# EAGLE design lasersupply_smd (EAGLE 5.11)
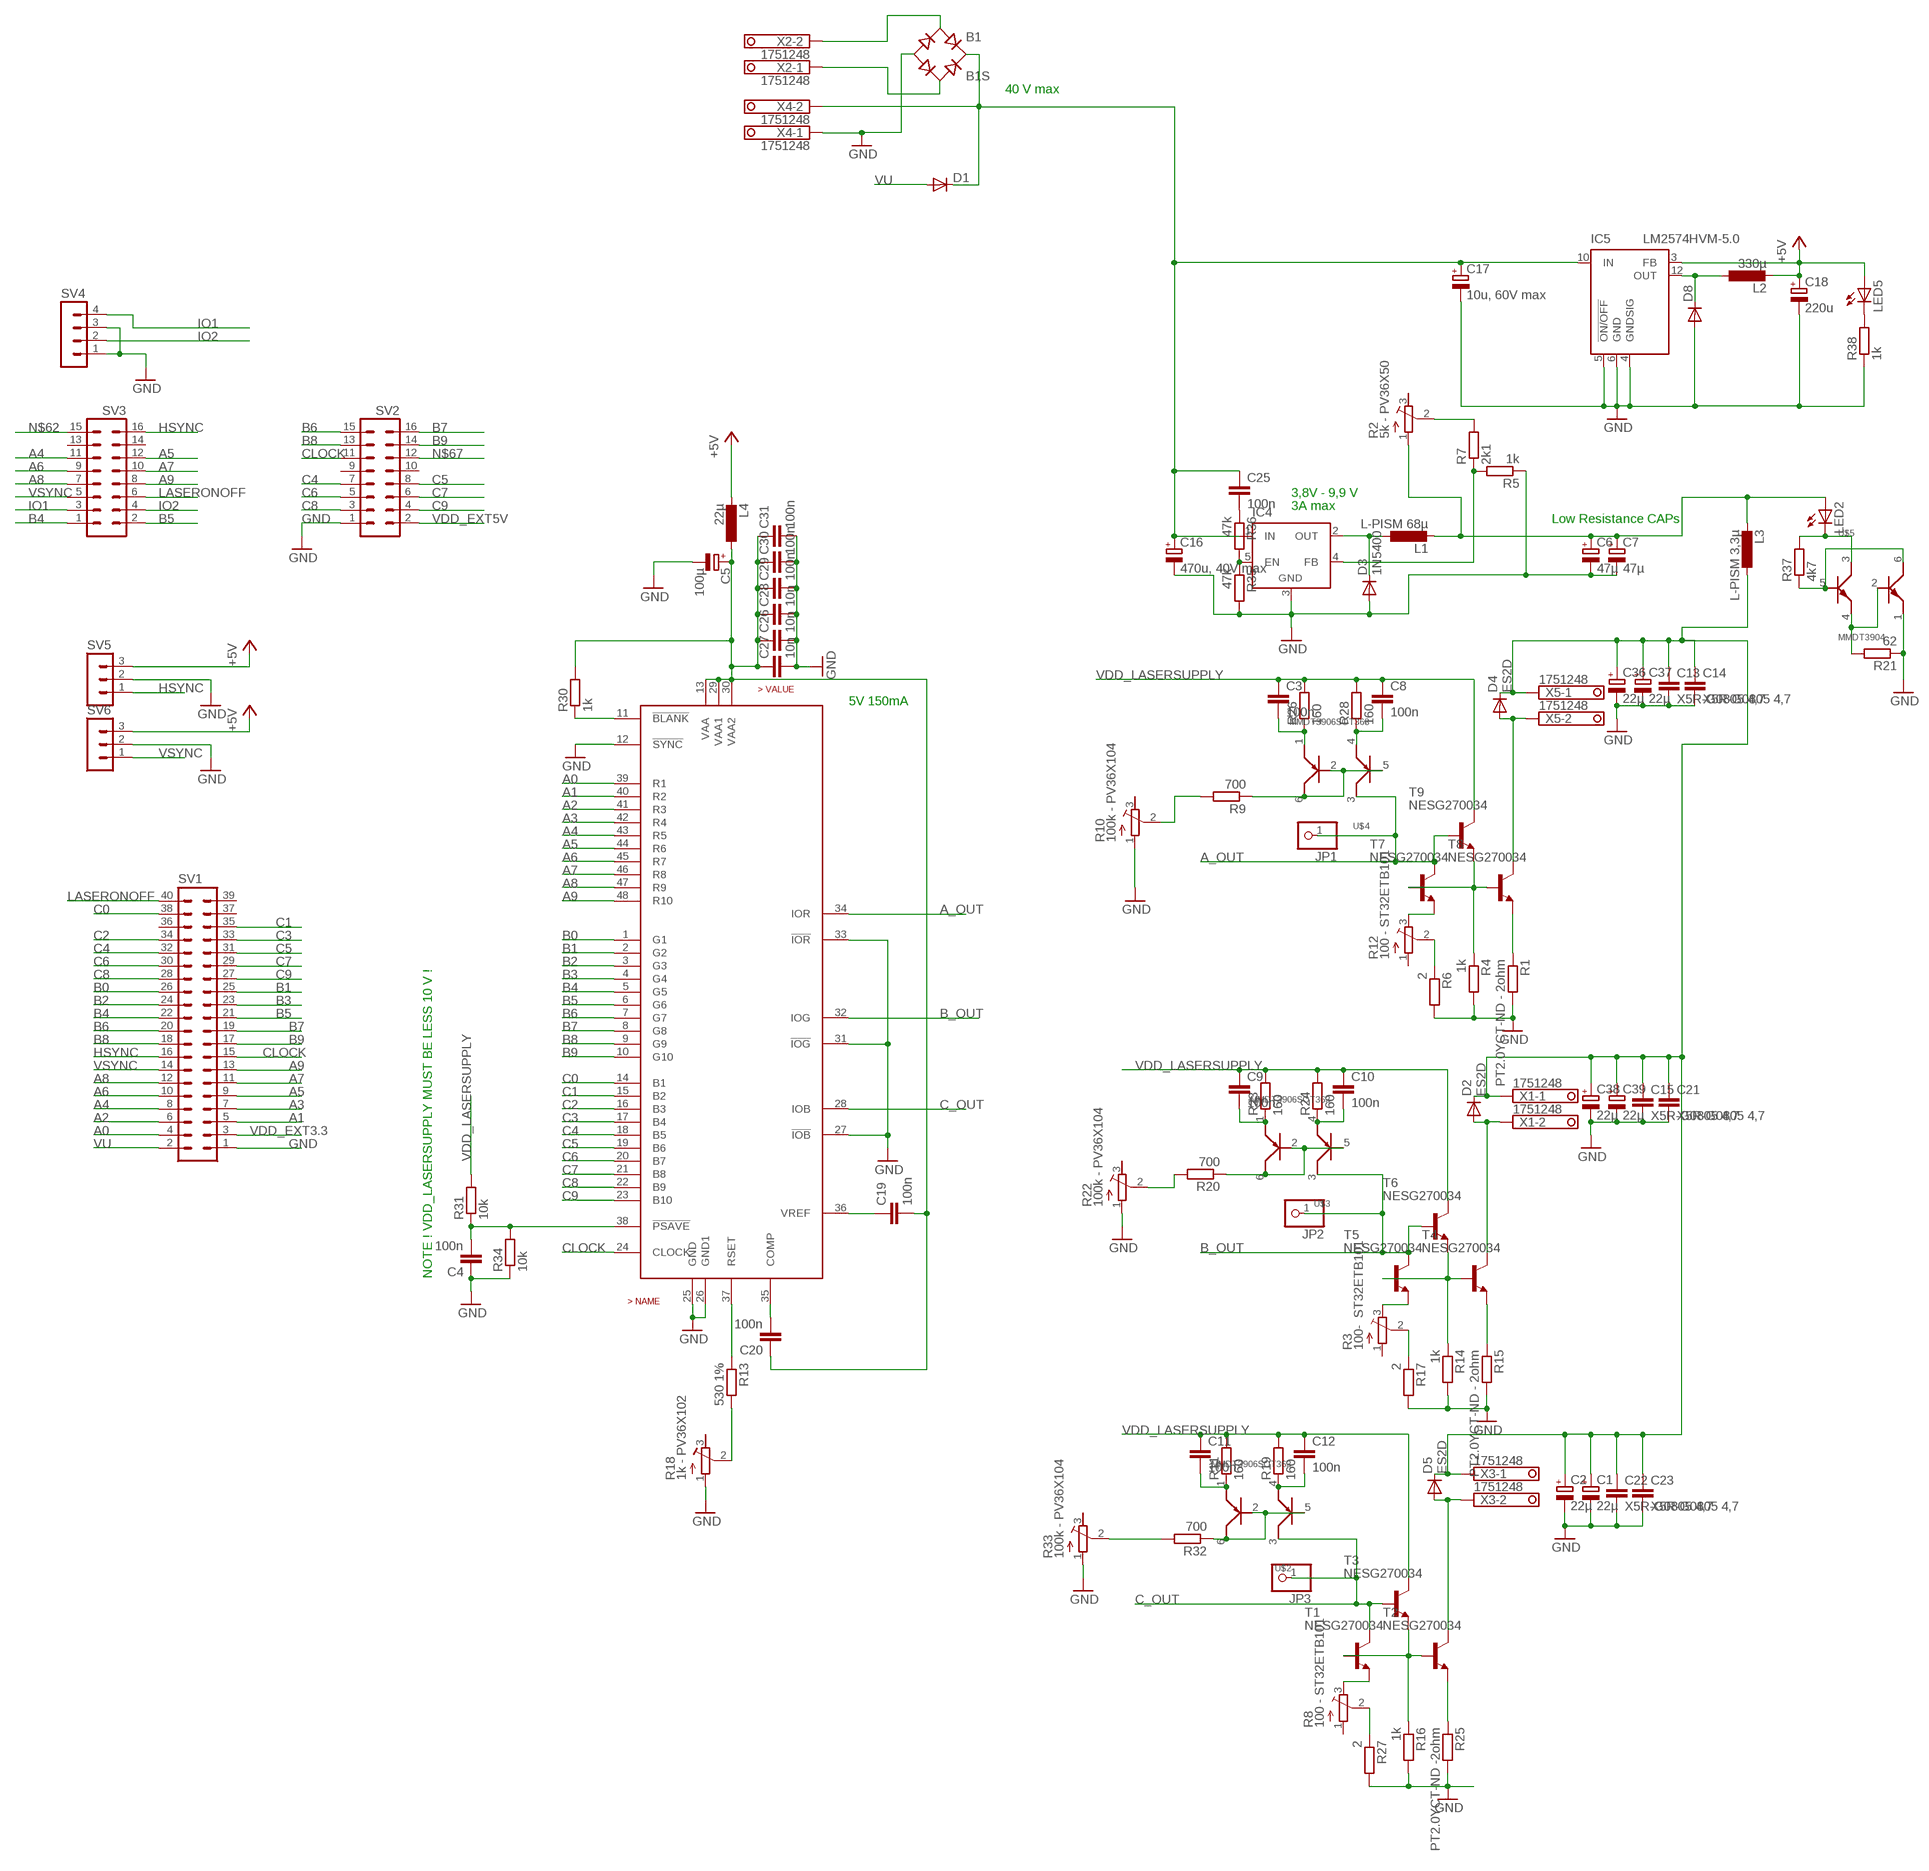
[diagram p0: schematic, sheet 1]

## Parts
B1  B1S  [MBS]
C1  22µ  CPOL-EUD  [PANASONIC_D]
C2  22µ  CPOL-EUD  [PANASONIC_D]
C3  100n  C-EUC0805  [C0805]
C4  100n  C-EUC0603  [C0603]
C5  100µ  CPOL-EUD  [PANASONIC_D]
C6  47µ  CPOL-EUD  [PANASONIC_D]
C7  47µ  CPOL-EUD  [PANASONIC_D]
C8  100n  C-EUC0805  [C0805]
C9  100n  C-EUC0805  [C0805]
C10  100n  C-EUC0805  [C0805]
C11  100n  C-EUC0805  [C0805]
C12  100n  C-EUC0805  [C0805]
C13  X5R-G0805 4,7  C-EUC0805  [C0805]
C14  X5R-G0805 4,7  C-EUC0805  [C0805]
C15  X5R-G0805 4,7  C-EUC0805  [C0805]
C16  470u, 40V max  CPOL-EUD  [PANASONIC_D]
C17  10u, 60V max  CPOL-EUD  [PANASONIC_D]
C18  220u  CPOL-EUD  [PANASONIC_D]
C19  100n  C-EUC0603  [C0603]
C20  100n  C-EUC0603  [C0603]
C21  X5R-G0805 4,7  C-EUC0805  [C0805]
C22  X5R-G0805 4,7  C-EUC0805  [C0805]
C23  X5R-G0805 4,7  C-EUC0805  [C0805]
C25  100n  C-EUC0805  [C0805]
C26  10n  C-EUC0603  [C0603]
C27  10n  C-EUC0603  [C0603]
C28  10n  C-EUC0603  [C0603]
C29  100n  C-EUC0603  [C0603]
C30  100n  C-EUC0603  [C0603]
C31  100n  C-EUC0603  [C0603]
C36  22µ  CPOL-EUD  [PANASONIC_D]
C37  22µ  CPOL-EUD  [PANASONIC_D]
C38  22µ  CPOL-EUD  [PANASONIC_D]
C39  22µ  CPOL-EUD  [PANASONIC_D]
D1  DIODE-MINIMELF  [MINIMELF]
D2  ES2D  DIODE-SOD323-R  [SOD323-R]
D3  1N5400  DIODE-SMB  [SMB]
D4  ES2D  DIODE-SOD323-R  [SOD323-R]
D5  ES2D  DIODE-SOD323-R  [SOD323-R]
D8  DIODE-SMB  [SMB]
IC4  LM2596TV  [TO220-51]
IC5  LM2574HVM-5.0  [SO14W]
JP1  PINHD-1X1  [1X01]
JP2  PINHD-1X1  [1X01]
JP3  PINHD-1X1  [1X01]
L1  L-PISM 68µ  L-EUPISM  [PISM]
L2  330µ  PIS2816  [PIS2816]
L3  L-PISM 3,3µ  L-EU0207/5V  [0207/5V]
L4  22µ  PIS2816  [PIS2816]
LED2  LEDCHIPLED_1206  [CHIPLED_1206]
LED5  LEDCHIPLED_1206  [CHIPLED_1206]
R1  PT2.0YCT-ND - 2ohm  R-EU_R2512  [R2512]
R2  5k - PV36X50  R-TRIMM64X  [RTRIM64X]
R3  100- ST32ETB101  TRIM_EU-SM-42/43A  [SM-42/43A]
R4  1k  R-EU_M0805  [M0805]
R5  1k  R-EU_M0805  [M0805]
R6  2  R-EU_M0805  [M0805]
R7  2k1  R-EU_M0805  [M0805]
R8  100 - ST32ETB101  TRIM_EU-SM-42/43A  [SM-42/43A]
R9  700  R-EU_M0805  [M0805]
R10  100k - PV36X104  R-TRIMM64X  [RTRIM64X]
R11  160  R-EU_R0805  [R0805]
R12  100 - ST32ETB101  TRIM_EU-SM-42/43A  [SM-42/43A]
R13  530 1%  R-EU_M0805  [M0805]
R14  1k  R-EU_M0805  [M0805]
R15  PT2.0YCT-ND - 2ohm  R-EU_R2512  [R2512]
R16  1k  R-EU_M0805  [M0805]
R17  2  R-EU_M0805  [M0805]
R18  1k - PV36X102  R-TRIMM64X  [RTRIM64X]
R19  160  R-EU_R0805  [R0805]
R20  700  R-EU_M0805  [M0805]
R21  62  R-EU_M0805  [M0805]
R22  100k - PV36X104  R-TRIMM64X  [RTRIM64X]
R23  160  R-EU_R0805  [R0805]
R24  160  R-EU_R0805  [R0805]
R25  PT2.0YCT-ND -2ohm  R-EU_R2512  [R2512]
R26  160  R-EU_R0805  [R0805]
R27  2  R-EU_R0805  [R0805]
R28  160  R-EU_R0805  [R0805]
R30  1k  R-EU_M0805  [M0805]
R31  10k  R-EU_M0805  [M0805]
R32  700  R-EU_M0805  [M0805]
R33  100k - PV36X104  R-TRIMM64X  [RTRIM64X]
R34  10k  R-EU_M0805  [M0805]
R35  47k  R-EU_M0805  [M0805]
R36  47k  R-EU_M0805  [M0805]
R37  4k7  R-EU_M0805  [M0805]
R38  1k  R-EU_M0805  [M0805]
SV1  ML40L  [ML40L]
SV2  MA08-2  [MA08-2]
SV3  MA08-2  [MA08-2]
SV4  MA04-1  [MA04-1]
SV5  MA03-1  [MA03-1]
SV6  MA03-1  [MA03-1]
T1  NESG270034  [SOT89-CEB]
T2  NESG270034  [SOT89-CEB]
T3  NESG270034  [SOT89-CEB]
T4  NESG270034  [SOT89-CEB]
T5  NESG270034  [SOT89-CEB]
T6  NESG270034  [SOT89-CEB]
T7  NESG270034  [SOT89-CEB]
T8  NESG270034  [SOT89-CEB]
T9  NESG270034  [SOT89-CEB]
U$1  ADV7123  [LQFP48]
U$2  MMDT3906SOT363  [SOT363_PHILIPS]
U$3  MMDT3906SOT363  [SOT363_PHILIPS]
U$4  MMDT3906SOT363  [SOT363_PHILIPS]
U$5  MMDT3904  [SOT363_PHILIPS]
X1  1751248  [1751248]
X2  1751248  [1751248]
X3  1751248  [1751248]
X4  1751248  [1751248]
X5  1751248  [1751248]

## Nets
+5V: C18.+ IC5.3(FB) L2.2 L4.2 LED5.A SV5.3 SV6.3
A0: SV1.4 U$1.39(R1)
A1: SV1.5 U$1.40(R2)
A2: SV1.6 U$1.41(R3)
A3: SV1.7 U$1.42(R4)
A4: SV1.8 SV3.11 U$1.43(R5)
A5: SV1.9 SV3.12 U$1.44(R6)
A6: SV1.10 SV3.9 U$1.45(R7)
A7: SV1.11 SV3.10 U$1.46(R8)
A8: SV1.12 SV3.7 U$1.47(R9)
A9: SV1.13 SV3.8 U$1.48(R10)
A_OUT: JP1.1 T7.C T9.B U$1.34(IOR) U$4.3(C1)
B0: SV1.26 U$1.1(G1)
B1: SV1.25 U$1.2(G2)
B2: SV1.24 U$1.3(G3)
B3: SV1.23 U$1.4(G4)
B4: SV1.22 SV3.1 U$1.5(G5)
B5: SV1.21 SV3.2 U$1.6(G6)
B6: SV1.20 SV2.15 U$1.7(G7)
B7: SV1.19 SV2.16 U$1.8(G8)
B8: SV1.18 SV2.13 U$1.9(G9)
B9: SV1.17 SV2.14 U$1.10(G10)
B_OUT: JP2.1 T5.C T6.B U$1.32(IOG) U$3.3(C1)
C0: SV1.38 U$1.14(B1)
C1: SV1.35 U$1.15(B2)
C2: SV1.34 U$1.16(B3)
C3: SV1.33 U$1.17(B4)
C4: SV1.32 SV2.7 U$1.18(B5)
C5: SV1.31 SV2.8 U$1.19(B6)
C6: SV1.30 SV2.5 U$1.20(B7)
C7: SV1.29 SV2.6 U$1.21(B8)
C8: SV1.28 SV2.3 U$1.22(B9)
C9: SV1.27 SV2.4 U$1.23(B10)
C_OUT: JP3.1 T1.C T3.B U$1.28(IOB) U$2.3(C1)
CLOCK: SV1.15 SV2.11 U$1.24(CLOCK)
GND: B1.- C1.- C2.- C4.1 C5.- C6.- C7.- C13.2 C14.2 C15.2 C16.- C17.- C18.- C21.2 C22.2 C23.2 C26.2 C27.2 C28.2 C29.2 C30.2 C31.2 C36.- C37.- C38.- C39.- D3.A D8.A IC4.3(GND) IC5.4(GNDSIG) IC5.5(!ON/OFF) IC5.6(GND) R1.2 R4.2 R5.1 R6.2 R10.1(E) R14.2 R15.2 R16.2 R17.2 R18.1(E) R21.1 R22.1(E) R25.2 R27.2 R33.1(E) R34.1 R35.2 R38.1 SV1.1 SV2.1 SV4.1 SV4.3 SV5.2 SV6.2 U$1.12(!SYNC) U$1.25(GND) U$1.26(GND1) U$1.27(!IOB) U$1.31(!IOG) U$1.33(!IOR) U$5.1(E2) X4.1
HSYNC: SV1.16 SV3.16 SV5.1
IO1: SV3.3 SV4.4
IO2: SV3.4 SV4.2
LASERONOFF: SV1.40 SV3.6
N$1: R1.1 T8.E
N$2: R30.1 U$1.11(!BLANK)
N$3: R3.3(E) T5.E
N$4: C19.1 U$1.36(VREF)
N$5: R3.2(S) R17.1
N$6: B1.AC1 X2.2
N$7: B1.AC2 X2.1
N$8: B1.+ C16.+ C17.+ C25.1 D1.C IC4.1(IN) IC5.10(IN) X4.2
N$9: IC4.4(FB) R5.2 R7.1
N$10: R4.1 T7.B T8.B T9.E
N$11: C20.2 U$1.35(COMP)
N$12: R2.2(S) R7.2
N$13: R8.3(E) T1.E
N$14: R8.2(S) R27.1
N$15: D8.C IC5.12(OUT) L2.1
N$16: R9.2 R10.2(S)
N$17: D3.C IC4.2(OUT) L1.1
N$18: R12.3(E) T7.E
N$19: C11.2 R11.1 U$2.1(E2)
N$20: R15.1 T4.E
N$21: R14.1 T4.B T5.B T6.E
N$22: R6.1 R12.2(S)
N$23: IC4.5(EN) R35.1 R36.2
N$24: R20.2 R22.2(S)
N$25: R32.2 R33.2(S)
N$26: R20.1 U$3.2(B2) U$3.5(B1) U$3.6(C2)
N$27: R9.1 U$4.2(B2) U$4.5(B1) U$4.6(C2)
N$28: C12.2 R19.1 U$2.4(E1)
N$29: R13.1 U$1.37(RSET)
N$30: R13.2 R18.2(S)
N$31: C9.2 R23.1 U$3.1(E2)
N$32: R16.1 T1.B T2.B T3.E
N$33: C10.2 R24.1 U$3.4(E1)
N$34: C4.2 R31.1 R34.2 U$1.38(!PSAVE)
N$35: C6.+ C7.+ L1.2 L3.2 LED2.A R2.1(E)
N$36: R32.1 U$2.2(B2) U$2.5(B1) U$2.6(C2)
N$37: C5.+ C19.2 C20.1 C26.1 C27.1 C28.1 C29.1 C30.1 C31.1 L4.1 R30.2 U$1.13(VAA) U$1.29(VAA1) U$1.30(VAA2)
N$38: C3.2 R26.1 U$4.1(E2)
N$39: C8.2 R28.1 U$4.4(E1)
N$40: C25.2 R36.1
N$41: R25.1 T2.E
N$43: R37.1 U$5.5(B1) U$5.6(C2)
N$44: LED2.C R37.2 U$5.3(C1)
N$45: R21.2 U$5.2(B2) U$5.4(E1)
N$47: LED5.C R38.2
N$56: D4.A T8.C X5.2
N$62: SV3.15
N$67: SV2.12
N$82: D2.A T4.C X1.2
N$84: D5.A T2.C X3.2
VDD_EXT3.3: SV1.3
VDD_EXT5V: SV2.2
VDD_LASERSUPPLY: C1.+ C2.+ C3.1 C8.1 C9.1 C10.1 C11.1 C12.1 C13.1 C14.1 C15.1 C21.1 C22.1 C23.1 C36.+ C37.+ C38.+ C39.+ D2.C D4.C D5.C L3.1 R11.2 R19.2 R23.2 R24.2 R26.2 R28.2 R31.2 T3.C T6.C T9.C X1.1 X3.1 X5.1
VSYNC: SV1.14 SV3.5 SV6.1
VU: D1.A SV1.2
Unconnected: R2.3(A) R3.1(A) R8.1(A) R10.3(A) R12.1(A) R18.3(A) R22.3(A) R33.3(A) SV1.36 SV1.37 SV1.39 SV2.9 SV2.10 SV3.13 SV3.14

## Notes on the sheet
- 40 V max
- 3,8V - 9,9 V
- 3A max
- Low Resistance CAPs
- 5V 150mA
- NOTE ! VDD_LASERSUPPLY MUST BE LESS 10 V !

## Library data of the parts
B1 = rectifier:B*S: Surface Mount Glass Passivated Bridge Rectifiers Source: Comchip Bridge Rectifiers B05S-G_B10S-G.pdf
C1 C2 C5-C7 C16-C18 C36-C39 = rcl:CPOL-EU: POLARIZED CAPACITOR, European symbol
C3 C4 C8-C15 C19-C23 C25-C31 = rcl:C-EU: CAPACITOR, European symbol
D1-D5 D8 = diode:DIODE-: DIODE
IC4 = linear:LM2596T: STEP-DOWN VOLTAGE REGULATOR
IC5 = linear:LM2574?-*: SIMPLE SWITCHER 0.5A Step-Down Voltage Regulator Source: http://cache.national.com/ds/LM/LM2574.pdf
JP1-JP3 = pinhead:PINHD-1X1: PIN HEADER
L1 = Inductor-Fastron:L-EU
L2 L4 = Labor:PIS2816
L3 = rcl:L-EU: INDUCTOR, European symbol
LED2 LED5 = led:LED: LED OSRAM: - CHIPLED LG R971, LG N971, LY N971, LG Q971, LY Q971, LO R971, LY R971 LH N974, LH R974 LS Q976, LO Q976, LY Q976 LO Q996 - Hyper CHIPLED LW Q18S LB Q993, LB Q99A, LB R99A - SideLED LS A670, LO A670, LY A670, LG A670, LP A670 LB A673, LV A673, LT A673, LW A673 LH A674 LY A675 LS A676, LA A676, LO A676, LY A676, LW A676 LS A679, LY A679, LG A679 - Hyper Micro SIDELED® LS Y876, LA Y876, LO Y876, LY Y876 LT Y87S - SmartLED LW L88C, LW L88S LB L89C, LB L89S, LG L890 LS L89K, LO L89K, LY L89K LS L896, LA L896, LO L896, LY L896 - TOPLED LS T670, LO T670, LY T670, LG T670, LP T670 LSG T670, LSP T670, LSY T670, LOP T670, LYG T670 LG T671, LOG T671, LSG T671 LB T673, LV T673, LT T673, LW T673 LH T674 LS T676, LA T676, LO T676, LY T676, LB T676, LH T676, LSB T676, LW T676 LB T67C, LV T67C, LT T67C, LS T67K, LO T67K, LY T67K, LW E67C LS E67B, LA E67B, LO E67B, LY E67B, LB E67C, LV E67C, LT E67C LW T67C LS T679, LY T679, LG T679 LS T770, LO T770, LY T770, LG T770, LP T770 LB T773, LV T773, LT T773, LW T773 LH T774 LS E675, LA E675, LY E675, LS T675 LS T776, LA T776, LO T776, LY T776, LB T776 LHGB T686 LT T68C, LB T68C - Hyper Mini TOPLED® LB M676 - Mini TOPLED Santana® LG M470 LS M47K, LO M47K, LY M47K Source: http://www.osram.convergy.de LUXEON: - LUMILED® LXK2-PW12-R00, LXK2-PW12-S00, LXK2-PW14-U00, LXK2-PW14-V00 LXK2-PM12-R00, LXK2-PM12-S00, LXK2-PM14-U00 LXK2-PE12-Q00, LXK2-PE12-R00, LXK2-PE12-S00, LXK2-PE14-T00, LXK2-PE14-U00 LXK2-PB12-K00, LXK2-PB12-L00, LXK2-PB12-M00, LXK2-PB14-N00, LXK2-PB14-P00, LXK2-PB14-Q00 LXK2-PR12-L00, LXK2-PR12-M00, LXK2-PR14-Q00, LXK2-PR14-R00 LXK2-PD12-Q00, LXK2-PD12-R00, LXK2-PD12-S00 LXK2-PH12-R00, LXK2-PH12-S00 LXK2-PL12-P00, LXK2-PL12-Q00, LXK2-PL12-R00 Source: www.luxeon.com KINGBRIGHT: KA-3528ASYC Source: www.kingbright.com
R1 R4 R9 R14-R17 R20 R25 R32 = resistor:R-EU_: RESISTOR, European symbol
R2 R10 R18 R22 R33 = rcl:R-TRIMM: Trimm resistor
R3 R8 R12 = pot:TRIM_EU-: POTENTIOMETER
R5-R7 R11 R13 R19 R21 R23 R24 R26-R28 R30 R31 R34-R38 = rcl:R-EU_: RESISTOR, European symbol
SV1 = con-ml:ML40L: HARTING; OC_FARNELL: unknown; OC_NEWARK: unknown
SV2 SV3 = con-lstb:MA08-2: PIN HEADER; OC_FARNELL: unknown; OC_NEWARK: unknown
SV4 = con-lstb:MA04-1: PIN HEADER; OC_FARNELL: unknown; OC_NEWARK: unknown
SV5 SV6 = con-lstb:MA03-1: PIN HEADER; OC_FARNELL: unknown; OC_NEWARK: unknown
T1-T9 = Labor:NESG270034: NPN TRANSISTOR
U$1 = Labor:ADV7123
U$2-U$4 = Labor:MMDT3906
U$5 = Labor:MMDT3904
X1-X5 = con-phoenix-350:1751248: MKDS 1/ 2-3,5 Printklemme Nennstrom: 10 A Bemessungsspannung: 160 V Raster: 3,5 mm Polzahl: 2 Montageart: Löten Anschlussart: Schraubanschluss Anschlussrichtung vom Leiter zur Platine: 0° Source: http://eshop.phoenixcontact.com .. 1751248.pdf

## Board
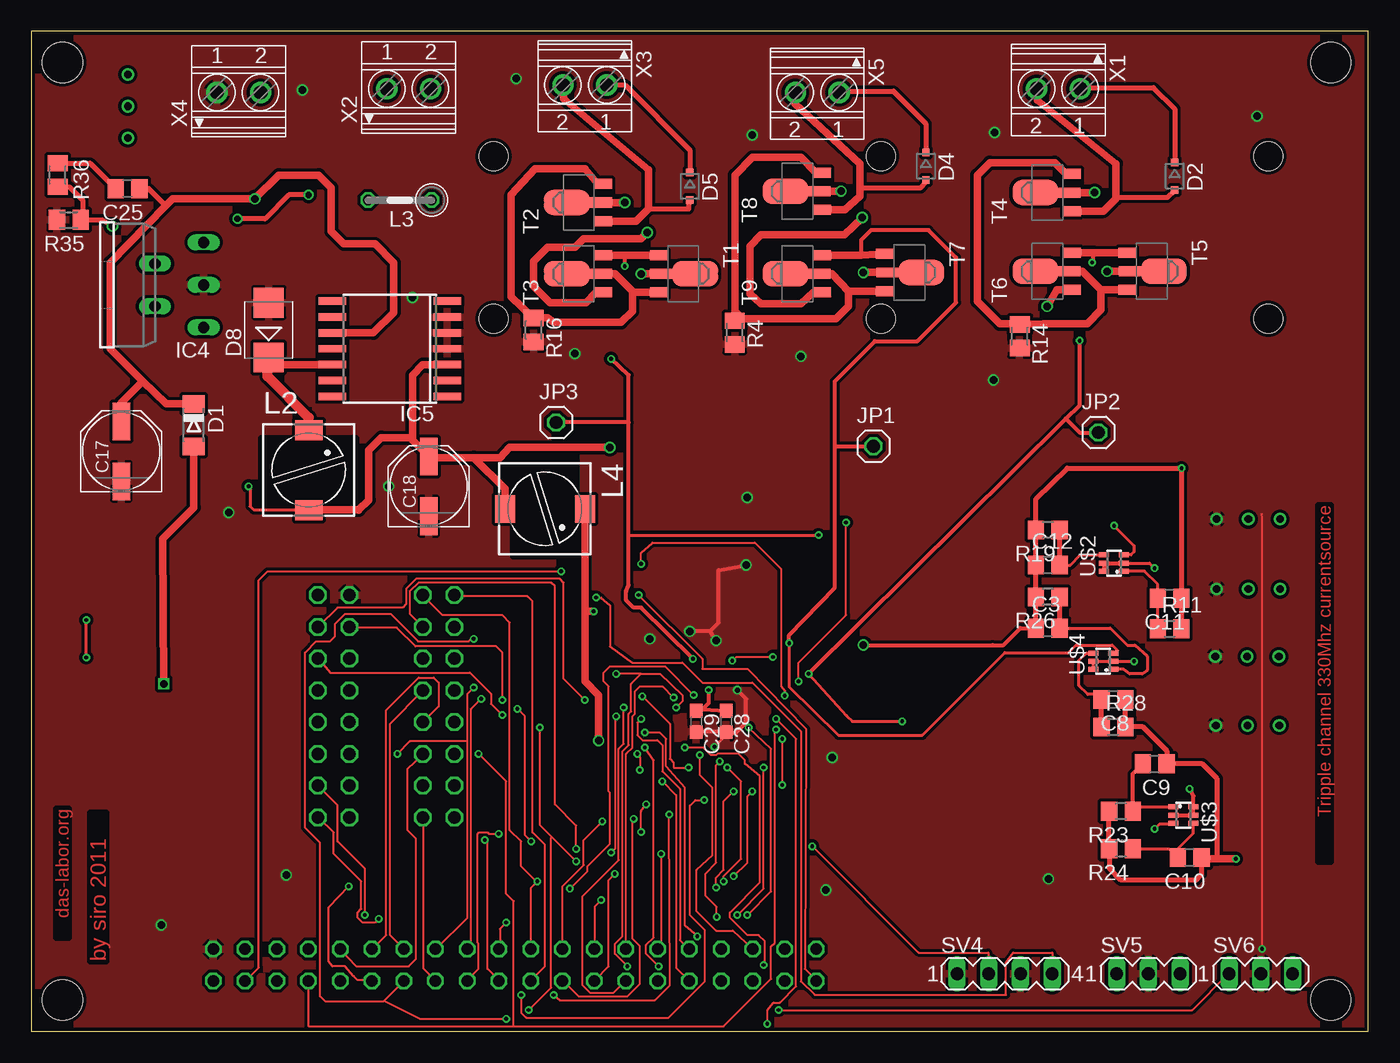
[diagram p1: board, top side]
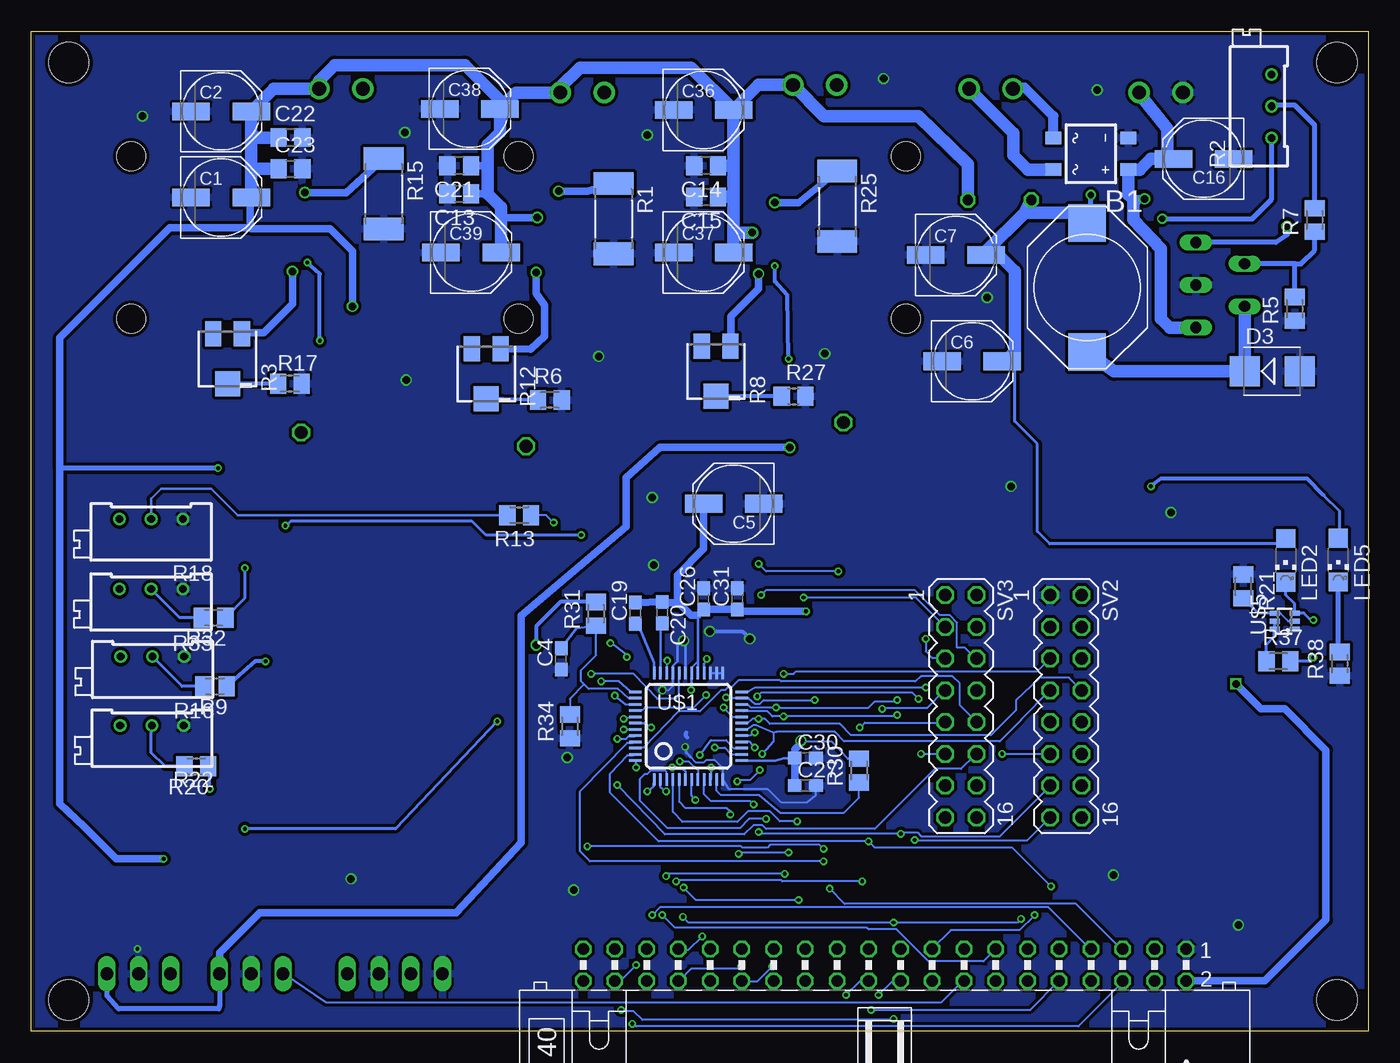
[diagram p2: board, bottom side, seen from below]

Size 107 x 80 mm. Coordinates in mm from the lower left corner, seen from the top.
Outline: 0,0 107,0 107,80 0,80 0,0
Copper layers (1*16): Top 0.035mm / dielectric 1.5mm / Bottom 0.035mm
Design rules "PCB-POOL Standard": minimum track width 0.15mm, minimum drill 0.3mm, track to track 0.15mm, track to pad 0.15mm, pad to pad 0.15mm, via to via 0.15mm, smd to smd 0.15mm, copper to edge 0.3mm, drill to drill 0.2mm, minimum pad ring 0.2mm, minimum via ring 0.15mm, stop-mask expansion 0.075mm, vias tented up to drill 0mil, thermal gap 0.2mm
Holes 3.2 mm at 104,2.5 104,77.5 2.5,77.5 2.5,2.5
Holes 2.3 mm at 99,70 99,57 37,57 37,70 68,57 68,70

### Footprints (pad centres in the part's own frame; a part is rotated, then mirrored left to right if it is on the bottom)
MBS = smd 1 x 1.3: + -1.27,-3; - 1.27,-3; AC1 -1.27,3; AC2 1.27,3
PANASONIC_D = smd 3 x 1.4: + 2.4,0; - -2.4,0
C0805 = smd 1.3 x 1.5: 1 -0.95,0; 2 0.95,0
C0603 = smd 1.1 x 1: 1 -0.85,0; 2 0.85,0
MINIMELF = smd 1.4 x 1.8: A 1.7,0; C -1.7,0
SOD323-R = smd 0.6 x 0.6: A 1.1,0; C -1.1,0
SMB = smd 2.4 x 2.4: A 2.2,0; C -2.2,0
TO220-51 = drill 0.9 long: 1 -3.4,-8.4; 2 -1.7,-4.5; 3 0,-8.4; 4 1.7,-4.5; 5 3.4,-8.4
SO14W = smd 0.6 x 2.2: 1 -3.81,-4.6; 2 -2.54,-4.6; 3 -1.27,-4.6; 4 0,-4.6; 5 1.27,-4.6; 6 2.54,-4.6; 7 3.81,-4.6; 8 3.81,4.6; 9 2.54,4.6; 10 1.27,4.6; 11 0,4.6; 12 -1.27,4.6; 13 -2.54,4.6; 14 -3.81,4.6
1X01 = drill 1.016 octagon: 1 0,0
PISM = smd 3 x 3: 1 -5.15,0; 2 5.15,0
PIS2816 = smd 2.2 x 1.6: 1 0,3.2; 2 0,-3.2
0207/5V = drill 0.813 octagon: 1 -2.54,0; 2 2.54,0
CHIPLED_1206 = smd 1.5 x 1.5: A 0,-1.75; C 0,1.75
R2512 = smd 1.8 x 3.2: 1 -2.8,0; 2 2.8,0
RTRIM64X = drill 0.61 round: 1 1.27,-2.54; 2 1.27,0; 3 1.27,2.54
SM-42/43A = smd 2 x 1.3: 1 2,1.15; 3 2,-1.15 | smd 2 x 2: 2 -2,0
M0805 = smd 1.3 x 1.6: 1 -0.95,0; 2 0.95,0
R0805 = smd 1.3 x 1.5: 1 -0.95,0; 2 0.95,0
ML40L = drill 0.914 octagon: 1 -24.13,-1.27; 2 -24.13,1.27; 3 -21.59,-1.27; 4 -21.59,1.27; 5 -19.05,-1.27; 6 -19.05,1.27; 7 -16.51,-1.27; 8 -16.51,1.27; 9 -13.97,-1.27; 10 -13.97,1.27; 11 -11.43,-1.27; 12 -11.43,1.27; 13 -8.89,-1.27; 14 -8.89,1.27; 15 -6.35,-1.27; 16 -6.35,1.27; 17 -3.81,-1.27; 18 -3.81,1.27; 19 -1.27,-1.27; 20 -1.27,1.27; 21 1.27,-1.27; 22 1.27,1.27; 23 3.81,-1.27; 24 3.81,1.27; 25 6.35,-1.27; 26 6.35,1.27; 27 8.89,-1.27; 28 8.89,1.27; 29 11.43,-1.27; 30 11.43,1.27; 31 13.97,-1.27; 32 13.97,1.27; 33 16.51,-1.27; 34 16.51,1.27; 35 19.05,-1.27; 36 19.05,1.27; 37 21.59,-1.27; 38 21.59,1.27; 39 24.13,-1.27; 40 24.13,1.27
MA08-2 = drill 1.016 octagon: 1 -8.89,-1.27; 2 -8.89,1.27; 3 -6.35,-1.27; 4 -6.35,1.27; 5 -3.81,-1.27; 6 -3.81,1.27; 7 -1.27,-1.27; 8 -1.27,1.27; 9 1.27,-1.27; 10 1.27,1.27; 11 3.81,-1.27; 12 3.81,1.27; 13 6.35,-1.27; 14 6.35,1.27; 15 8.89,-1.27; 16 8.89,1.27
MA04-1 = drill 1.016 long: 1 -3.81,0; 2 -1.27,0; 3 1.27,0; 4 3.81,0
MA03-1 = drill 1.016 long: 1 -2.54,0; 2 0,0; 3 2.54,0
SOT89-CEB = smd 0.8 x 1.4: B 1.499,-1.981; C -1.499,-1.981 | smd 0.8 x 1.9: E 0,-1.727 | smd 2.032 x 3.65: E@1 0,0.94
LQFP48 = smd 0.2 x 1: 1 -2.75,-4.25; 2 -2.25,-4.25; 3 -1.75,-4.25; 4 -1.25,-4.25; 5 -0.75,-4.25; 6 -0.25,-4.25; 7 0.25,-4.25; 8 0.75,-4.25; 9 1.25,-4.25; 10 1.75,-4.25; 11 2.25,-4.25; 12 2.75,-4.25; 25 2.75,4.25; 26 2.25,4.25; 27 1.75,4.25; 28 1.25,4.25; 29 0.75,4.25; 30 0.25,4.25; 31 -0.25,4.25; 32 -0.75,4.25; 33 -1.25,4.25; 34 -1.75,4.25; 35 -2.25,4.25; 36 -2.75,4.25 | smd 1 x 0.2: 13 4.25,-2.75; 14 4.25,-2.25; 15 4.25,-1.75; 16 4.25,-1.25; 17 4.25,-0.75; 18 4.25,-0.25; 19 4.25,0.25; 20 4.25,0.75; 21 4.25,1.25; 22 4.25,1.75; 23 4.25,2.25; 24 4.25,2.75; 37 -4.25,2.75; 38 -4.25,2.25; 39 -4.25,1.75; 40 -4.25,1.25; 41 -4.25,0.75; 42 -4.25,0.25; 43 -4.25,-0.25; 44 -4.25,-0.75; 45 -4.25,-1.25; 46 -4.25,-1.75; 47 -4.25,-2.25; 48 -4.25,-2.75
SOT363_PHILIPS = smd 0.4 x 0.8: 1 -0.65,-0.8; 2 0,-0.8; 3 0.65,-0.8; 4 0.65,0.8; 5 0,0.8; 6 -0.65,0.8
1751248 = drill 1.1 pad 1.7 round: 1 -1.75,-0.1; 2 1.75,-0.1

### Placement (x,y rotation side)
B1  22.2,70.2 90 bottom
C1  91.8,66.7 0 bottom
C2  91.8,73.6 0 bottom
C3  81.35,32.25 0 top
C4  64.6,29.8 90 bottom
C5  50.8,42.2 180 bottom
C6  31.7,53.6 0 bottom
C7  33,62.1 0 bottom
C8  86.6,26.55 180 top
C9  89.9,21.4 180 top
C10  92.7,13.9 180 top
C11  91.1,34.65 180 top
C12  81.35,37.3 0 top
C13  72.75,67 180 bottom
C14  53,69.25 180 bottom
C15  53,66.75 180 bottom
C16  13.2,69.8 180 bottom
C17  7.2,46.4 90 top
C18  31.8,43.6 90 top
C19  58.65,33.45 90 bottom
C20  56.5,33.5 270 bottom
C21  72.75,69.25 180 bottom
C22  86.25,71.5 0 bottom
C23  86.25,69 0 bottom
C25  7.7,67.4 180 top
C26  53.2,34.6 90 bottom
C27  45.05,19.65 0 bottom
C28  55.6,24.8 270 top
C29  53.2,24.8 270 top
C30  45.05,21.85 0 bottom
C31  50.5,34.6 90 bottom
C36  53.2,73.7 0 bottom
C37  53.2,62.3 0 bottom
C38  71.9,73.8 0 bottom
C39  71.8,62.3 0 bottom
D1  13,48.5 270 top
D2  91.5,68.4 270 top
D3  7.7,52.8 0 bottom
D4  71.6,69.2 270 top
D5  52.7,67.6 270 top
D8  19,56.1 90 top
IC4  5.4,59.7 90 top
IC5  28.7,54.6 90 top
JP1  67.4,46.8 0 top
JP2  85.4,47.9 0 top
JP3  42,48.7 0 top
L1  22.5,59.5 90 bottom
L2  22.2,44.9 0 top
L3  29.5,66.5 180 top
L4  41.1,41.8 270 top
LED2  6.61,37.68 180 bottom
LED5  2.4,37.7 180 bottom
R1  60.4,65 270 bottom
R2  9,74 0 bottom
R3  91.3,53.8 90 bottom
R4  56.3,55.9 270 top
R5  5.9,57.8 90 bottom
R6  65.5,50.5 0 bottom
R7  4.3,64.9 90 bottom
R8  52.2,52.8 90 bottom
R9  92.3,27.6 180 bottom
R10  97.3,28.7 90 bottom
R11  91.1,32.2 0 top
R12  70.6,52.6 90 bottom
R13  67.95,41.3 180 bottom
R14  79.1,55.6 270 top
R15  78.8,67 270 bottom
R16  40.2,56.1 270 top
R17  86.3,51.8 0 bottom
R18  97.4,39.7 90 bottom
R19  81.35,40.1 180 top
R20  93.8,21.2 180 bottom
R21  10,35.6 270 bottom
R22  97.34,23.2 90 bottom
R23  87.2,17.6 180 top
R24  87.2,14.6 180 top
R25  42.5,66 270 bottom
R26  81.35,34.75 180 top
R27  46,50.8 0 bottom
R28  86.6,24.35 0 top
R30  40.75,20.85 90 bottom
R31  61.8,33.4 90 bottom
R32  92.4,33.1 180 bottom
R33  97.4,34.1 90 bottom
R34  63.9,24.4 90 bottom
R35  3,64.9 180 top
R36  2.1,68.5 270 top
R37  7.2,29.6 0 bottom
R38  2.3,29.4 90 bottom
SV1  38.7,5.3 180 bottom
SV2  24.2,26 270 bottom
SV3  32.6,26 270 bottom
SV4  77.9,4.6 0 top
SV5  89.4,4.6 0 top
SV6  98.4,4.6 0 top
T1  52.2,60.6 270 top
T2  43.8,66.3 90 top
T3  43.8,60.6 90 top
T4  81.3,67.1 90 top
T5  89.7,60.8 270 top
T6  81.3,60.8 90 top
T7  70.3,60.7 270 top
T8  61.3,67.2 90 top
T9  61.3,60.6 90 top
U$1  54.4,24.4 0 bottom
U$2  86.65,37.46 90 top
U$3  92.19,17.3 270 top
U$4  85.78,29.6 90 top
U$5  6.7,32.8 90 bottom
X1  82.2,75.3 180 top
X2  30.2,75.5 0 top
X3  44.3,75.6 180 top
X4  16.6,75.2 0 top
X5  62.9,75 180 top

### Tracks (layer width: path | path; a pad name or v marks a point on that pad's centre or on a via)
+5V  (via drill 0.3, 0.6)
  Top 0.254: L2.2 17.8,41.7 17.5,42 17.5,43.5 v17.4,43.6
  Top 0.406: C18.+ 31.9,45.9
  Top 0.61: IC5.3 31.33,53.33 30.5,52.5 30.5,47.5 | 30.5,47.5 30.5,47.3 C18.+ | L2.2 26.2,41.7 27,42.5 27,46.5 28,47.5 30.5,47.5 | 31.9,45.9 35.4,45.9 | L4.2 37.9,43.4 35.4,45.9 | 35.4,45.9 37.5,45.9 38.3,46.7 v46.3,46.7
  Bottom 0.254: 3.6,42.9 2.3,41.6 2.3,39.55 LED5.A
  Bottom 0.305: 3.6,42.9 4.9,44.2 16.6,44.2 v17.4,43.6
  Bottom 0.406: SV6.3 100.94,2.84 100,1.8 92,1.8 91.94,2.06 SV5.3
  Bottom 0.61: v46.3,46.7 56.7,46.7 59.4,44.3 59.4,40.35 67.8,33.25 67.8,15.1 73,9.5 88.7,9.5 91.9,6.3 91.9,4.64 SV5.3
A0  (via drill 0.3)
  Top 0.15: v42.4,36.8 18.9,36.8 18.2,36.1 18.2,5.1 17.2,4.1 SV1.4 | v48.8,37.4 48.8,38.3 49.7,39.1 57.9,39.1 60,37 60,27.6 60.3,27.2 v60.3,26.85
  Bottom 0.15: v48.8,37.4 48.2,36.8 v42.4,36.8 | U$1.39 59.45,26.15 v60.3,26.85
A1  (via drill 0.3)
  Top 0.15: v53,26.9 50.7,29.2 46.3,29.2 45.8,28.7 45.8,28 46.2,27.6 46.2,19.2 46.3,19.1 46.3,15 44.5,13.2 44.5,12.8 v43.1,11.4
  Bottom 0.15: v53,26.9 54,25.9 57.9,25.9 58.1,25.7 58.6,25.7 U$1.40 | v43.1,11.4 41.9,10.2 23.4,10.2 19.8,6.6 19.7,6.6 SV1.5
A2  (via drill 0.3)
  Top 0.15: v59.6,25 61.2,23.4 61.2,3.6 59.9,2.3 59.4,2.3 58.9,1.7 v58.9,0.6
  Bottom 0.15: v59.6,25 59.4,25.1 U$1.41 | v58.9,0.6 58.6,0.4 23.2,0.4 19.6,4 SV1.6
A3  (via drill 0.3)
  Top 0.15: v57.4,24.3 59.2,22.6 59.2,11.2 v57.3,9.3
  Bottom 0.15: v57.3,9.3 56.7,9.9 25.6,9.9 22.3,6.6 22.2,6.6 SV1.7
  Bottom 0.2: U$1.42 57.95,24.65 v57.4,24.3
A4  (via drill 0.3)
  Top 0.15: v59.6,24.15 59.5,23.9 59.5,7.1 59.2,6.8 59.2,4.2 55.4,0.4 38.6,0.4 | 38.6,0.4 22.2,0.4 22.2,4 SV1.8 | v35.8,22.2 38,20 38,11 38.6,10.4 38.6,0.4
  Bottom 0.15: v59.6,24.15 U$1.43 | v35.8,22.2 33.9,22.2 SV3.11
A5  (via drill 0.3)
  Top 0.15: v60.1,19.7 v60.1,23.4 | SV1.9 26,5.2 30.2,5.2 30.8,5.8 30.8,15.4 30.1,16.1 30.1,21 31.3,22.1 SV3.12
  Bottom 0.15: v60.1,23.4 59.4,23.4 59.2,23.6 58.7,23.6 U$1.44 | v60.1,19.7 56.3,15.75 49.95,15.75 49.2,16.5 48.5,16.5 48.2,16.2 39.5,16.2 34.7,21 32.6,21 31.5,22.1 31.4,22.1 SV3.12
A6  (via drill 0.3)
  Top 0.15: 41.65,15.55 40.7,16.5 v40.7,24.3 | 41.65,15.55 v43.6,13.6 | v39.8,1.7 41.6,3.5 41.6,15.5 41.65,15.55
  Bottom 0.15: v43.6,13.6 62.3,13.6 63.1,14.4 63.1,19.2 59.3,23.1 58.8,23.1 U$1.45 | v40.7,24.3 40.3,24.7 33.9,24.7 SV3.9 | v39.8,1.7 27.1,1.7 24.8,4 SV1.10
A7
  Top 0.15: SV1.11 28.4,7.7 28.4,25.7 31,28.3 32.2,28.3 32.6,27.9 32.6,26 SV3.10
  Bottom 0.15: U$1.46 58.5,22.7 58,22.7 55.2,25.6 53.5,25.6 51.8,27.3 51.5,27.3 51.3,27.5 51,27.5 50.4,28.1 47.1,28.1 47,28 36.25,28 35.8,28.4 33.3,28.4 32.7,27.85 32.7,26.1 SV3.10
A8  (via drill 0.3)
  Top 0.15: v40,15.2 39.5,15.7 39.5,25.2 v38.9,25.8 | v25.4,11.6 23.8,9.9 23.8,5.6 24.1,5.2 25.1,5.2 25.8,4.4 26.1,4.1 27.2,4.1 SV1.12
  Bottom 0.15: v38.9,25.8 38.8,25.9 35.3,25.9 34,27.2 33.9,27.2 SV3.7 | U$1.47 58.8,22.1 59.3,22.1 60.7,20.6 60.7,19.1 56.8,15.2 v40,15.2 39.5,14.7 28.5,14.7 v25.4,11.6
A9  (via drill 0.3)
  Top 0.15: v58.6,21.1 58.6,11.4 v56.5,9.3 | SV3.8 31.3,27.2 28.7,24.6 28.7,7.7 29.8,6.6 SV1.13
  Bottom 0.15: v58.6,21.1 58.6,21.6 U$1.48 | v56.5,9.3 55.5,8.3 40.15,8.3 40,8.15 37.75,8.15 35.2,5.6 30.8,5.6 29.9,6.5 SV1.13
A_OUT  (via drill 0.3)
  Top 0.15: v56.1,29.65 56.45,29.95 v59.35,29.95
  Top 0.254: v60.65,31.05 60.65,27.55 64.6,23.7 71.3,23.7 77.9,30.3 83,30.3 83.6,30.9 86.5,30.9 86.93,30.47 U$4.3
  Top 0.305: 64.3,46.8 64.3,52 67.5,55.2 70.9,55.2 74,58.3 74,61.9 71.8,64.1 67.2,64.1 66.4,63.3 66.4,62.1 | v60.65,31.05 60.65,31.7 64.3,35.5 64.3,46.8 | 64.3,46.8 JP1.1
  Top 0.61: T9.B 66.4,62.1 T7.C
  Bottom 0.15: U$1.34 v56.1,29.65 | v59.35,29.95 59.5,30.2 60.55,31.05 v60.65,31.05
B0  (via drill 0.3)
  Top 0.15: v57.7,19.2 57.3,18.8 57.3,13.5 v56.2,12.4 | v46.7,12.6 46.2,12.1 46.2,5.2 45.1,4.1 SV1.26
  Bottom 0.15: v57.7,19.2 57.2,19.6 U$1.1 | v56.2,12.4 56,12.6 v46.7,12.6
B1  (via drill 0.3)
  Top 0.15: v56.2,19.2 55.4,18.4 55.4,12.9 54.8,12.3 v54.8,11.5 | v45.6,10.5 45.1,10 45.1,6.6 SV1.25
  Bottom 0.15: v56.2,19.2 56.65,19.5 U$1.2 | v54.8,11.5 53.8,10.5 v45.6,10.5
B2  (via drill 0.3)
  Top 0.15: v48.2,17 48.1,16.9 48.1,7.4 48.7,6.8 48.7,3.8 47.7,2.8 43.8,2.8 42.6,4 SV1.24
  Bottom 0.15: v48.2,17 49.55,17 50.3,16.25 56.1,16.25 58.3,18.45 58.3,20.2 57.9,20.6 57.7,20.6 57.4,20.9 56.3,20.9 56.2,20.8 56.2,20.2 U$1.3
B3  (via drill 0.3)
  Top 0.15: v45.7,16.8 44.2,15.3 44.2,13.3 42.5,11.6 42.5,6.6 SV1.23
  Bottom 0.15: v45.7,16.8 47.1,16.8 47.9,17.6 49.65,17.6 50.5,16.75 54.9,16.75 55.65,17.55 U$1.4
B4  (via drill 0.3)
  Top 0.15: v51.05,17.35 51.05,17.15 51.1,3.7 49.9,2.5 42.3,2.5 v41.8,2.9 | SV3.1 33.9,34.8 39.7,34.8 40.1,34.4 40.1,15.9 41.1,14.9 41.1,5.2 40,4.1 SV1.22
  Bottom 0.15: v41.8,2.9 40.7,4 40,4 SV1.22 | U$1.5 55.13,20.1 55.13,18.35 54.63,17.85 51.35,17.85 51.05,17.55 v51.05,17.35
B5  (via drill 0.3)
  Top 0.15: v55.7,21.1 56.8,20 56.8,13.8 55.4,12.4 v55.4,12 | SV1.21 40,6.6 40,11.5 v40.5,12 40.4,12 39.2,13.2 39.2,15.2 38.3,16.1 38.3,32.7 37.7,33.3 32.9,33.3 31.4,34.8 SV3.2
  Bottom 0.15: v55.7,21.1 55.6,21 54.9,21 54.65,20.8 U$1.6 | v55.4,12 55.3,12.1 47,12.1 46.9,12 v40.5,12
B6  (via drill 0.3)
  Top 0.15: v53.85,18.5 53.15,18.5 52.7,18.05 52.7,9.3 53.9,8.1 53.9,4 51,1.1 39.6,1.1 39.2,1.5 v39.2,2.9 | v36.3,15.3 36.5,15.1 36.5,5 37.4,4.1 SV1.20
  Bottom 0.15: v53.85,18.5 54.15,18.9 U$1.7 | v39.2,2.9 38.1,4 37.5,4 SV1.20 | v36.3,15.3 27.3,15.3 25.5,17.1 SV2.15
B7  (via drill 0.3)
  Top 0.15: v55.1,21.6 54.8,21.3 54.8,13.5 53.95,12.6 53.95,10.85 54.85,9.95 v54.85,9.15 | v38,8.7 37.5,8.2 37.5,6.6 SV1.19 | v27.8,9 27.5,8.7 26.5,8.7 26.1,9.1 26.1,9.5 26.4,9.8 26.4,12 24.2,14.2 24.2,15.9 23,17.1 SV2.16
  Bottom 0.15: v55.1,21.6 54.4,21.6 53.65,20.9 U$1.8 | v54.85,9.15 54.4,8.7 v38,8.7 28.1,8.7 v27.8,9
B8  (via drill 0.3)
  Top 0.15: v49.2,18.15 48.8,17.6 v48.8,15.95 | v37.4,15.8 36.6,15.8 36.5,15.9 35.85,15.9 35.7,15.75 35.7,7.1 35.8,7 35.8,5 34.9,4.1 SV1.18
  Bottom 0.15: v48.8,15.95 48.65,15.8 v37.4,15.8 37.2,15.9 36.1,15.9 35.8,15.6 29.5,15.6 25.5,19.6 SV2.13 | U$1.9 53.15,18.95 52.6,18.4 49.45,18.4 v49.2,18.15
B9  (via drill 0.3)
  Top 0.15: v52.6,21.1 51.4,21.1 51.4,21.5 51.1,21.8 51.1,24.6 v48.9,26.8 | v36,26.6 35.2,25.8 35.2,6.9 34.9,6.6 SV1.17 | v26.7,9.3 26.7,13 24.5,15.2 24.5,18.1 23,19.6 SV2.14
  Bottom 0.15: v52.6,21.1 52.6,20.2 U$1.10 | v48.9,26.8 48.6,27.1 36.5,27.1 v36,26.6 | v26.7,9.3 27.9,8.1 33.4,8.1 34.9,6.6 SV1.17
B_OUT  (via drill 0.3)
  Top 0.254: v62.2,28.6 65.25,25.25 65.7,24.8 v69.7,24.8 | v89.9,16.2 90.3,16.6 91.34,16.6 U$3.3
  Top 0.305: v83.9,55.25 83.9,50.1 82.8,49 | v62.2,28.6 82.8,49 | 82.8,49 83.9,47.9 JP2.1 | v84.9,61.5 85,61.5 85,62.3
  Top 0.61: T6.B 85,62.3 T5.C
  Bottom 0.15: v62.2,28.6 58.8,28.6 56.9,26.6 55.45,26.6 55.15,26.95 U$1.32
  Bottom 0.254: v89.9,16.2 77.85,16.2 v69.7,24.8
  Bottom 0.305: v83.9,55.25 83.9,60.6 v84.9,61.5
C0  (via drill 0.3)
  Top 0.15: v58.6,5.3 58.7,5.4 58.7,7.2 58.2,7.7 57.3,7.7 55.9,9.1 55.9,9.5 58.3,11.9 58.3,20.4 57.1,21.4 57.1,21.7 56.6,22.2 54.9,22.2 54.8,22.1 54.4,22.1 53.8,22.7 v52.3,22.7
  Bottom 0.15: v52.3,22.7 51.5,22.7 51,22.15 U$1.14 | v58.6,5.3 59.8,4.1 60.2,4.1 SV1.38
C1  (via drill 0.3)
  Top 0.15: v53.5,22.1 53.5,20.5 54.5,19.5 54.5,14.1 53.25,12.9 53.25,9.6 54.8,8.05 56.15,8.05 57.7,6.6 SV1.35
  Bottom 0.15: v53.5,22.1 52.6,23.3 51.4,23.3 50.8,22.65 U$1.15
C2  (via drill 0.3)
  Top 0.15: v49.1,22.7 49.8,21.7 49.8,7.5 49.2,6.9 49.2,6.2 v50.2,5.2
  Bottom 0.15: v49.1,22.7 49.5,23.15 U$1.16 | v50.2,5.2 50.4,5 54.2,5 55.1,4.1 55.2,4.1 SV1.34
C3  (via drill 0.3)
  Top 0.15: v49.1,23.9 50.3,23.9 50.8,23.4 50.8,21.2 52.3,19.5 52.3,8.45 v53.3,7.6
  Bottom 0.15: v49.1,23.9 49.3,23.9 49.5,23.65 U$1.17 | v53.3,7.6 54.45,6.5 55.2,6.5 SV1.33
C4  (via drill 0.3)
  Top 0.15: v50.5,20 51.6,18.9 51.6,5.1 SV1.32 | v48.5,22.2 48.7,21.9 v48.7,20.9
  Bottom 0.15: v48.5,22.2 47.6,23.2 47.6,23.9 | v48.7,20.9 49.5,20.1 50.5,20.1 v50.5,20 | U$1.18 49.7,24.15 49.2,24.5 49,24.5 47.6,23.9 | 47.6,23.9 47.35,23.95 42.7,23.95 41.95,23.2 29.5,23.2 27.8,24.9 27.8,24.94 SV2.7
C5  (via drill 0.3)
  Top 0.15: v48.8,25 48.5,24.7 48.5,23.7 48.9,23.3 50.1,23.3 50.5,22.9 50.5,20.8 51.9,19.4 51.9,7.3 52.6,6.6 SV1.31
  Bottom 0.15: U$1.19 49.7,24.65 49.3,25 v48.8,25 48.3,25 47.9,24.6 42.3,24.6 41.4,23.7 30.2,23.7 28.2,25.7 28.2,26.5 26.3,28.3 23.96,28.3 SV2.8
C6  (via drill 0.3)
  Top 0.15: v51.6,25.9 52.1,26.4 52.1,26.9 50.3,28.6 48.8,28.6 | 48.8,28.6 48,27.8 48,25.6 47.8,25.4 47.8,22.9 47.3,22.4 47.3,7.6 46.7,7 46.7,6.2 v47.7,5.2 | 48.8,28.6 v46.8,28.6
  Bottom 0.15: v51.6,25.9 50.9,25.15 U$1.20 | v47.7,5.2 48.9,4 50.1,4 SV1.30 | v46.8,28.6 46,28.6 45.8,28.8 26.5,28.8 25.5,29.8 SV2.5
C7  (via drill 0.3)
  Top 0.15: v37.7,25.3 36.8,26.2 36.8,27 35.1,28.7 23.9,28.7 23,29.8 SV2.6 | v50.4,14.2 50.4,6.8 50.2,6.6 SV1.29 | v46.4,14.3 46.7,14.6 46.7,25.1 v46.8,25.2
  Bottom 0.15: v37.7,25.3 37.8,25.2 v46.8,25.2 47.7,25.2 48.1,25.6 50,25.6 U$1.21 | v50.4,14.2 50.3,14.3 v46.4,14.3
C8  (via drill 0.3)
  Top 0.15: v47.4,25.9 47.4,23 47,22.6 47,13.7 44.1,10.8 44.1,3.7 44.7,3.1 46.6,3.1 47.5,4 SV1.28 | v37.7,26.5 37.7,30.3 37.2,30.8 30.75,30.8 29.25,32.3 25.5,32.3 SV2.3
  Bottom 0.15: 50.2,26.15 U$1.22 49.7,26.15 49.4,25.9 v47.4,25.9 40,25.9 39.5,26.4 37.8,26.4 v37.7,26.5
C9  (via drill 0.3)
  Top 0.15: v51.4,26.7 50.5,27.6 48.7,27.6 48.3,27.2 48.3,25.4 48.1,25.2 48.1,22.7 47.6,22.2 47.6,6.6 SV1.27 | v44.3,26.5 42.6,28.2 42.6,35.9 42.3,36.2 30.8,36.2 30,35.4 30,34.2 29.7,33.9 24.5,33.9 23,32.4 SV2.4
  Bottom 0.15: v51.4,26.7 50.3,26.7 U$1.23 49.6,26.65 49.1,26.2 48.7,26.2 48.4,26.5 v44.3,26.5
C_OUT  (via drill 0.3)
  Top 0.254: 47.8,39.7 v63,39.7 | U$2.3 88.01,38.11 88.25,38.35 88.25,38.85 v86.65,40.45
  Top 0.305: v47.5,61.2 47.5,62.1 | v52.95,29.8 48.8,33.9 48.2,33.9 47.6,34.5 47.6,35.2 47.8,35.7 47.8,39.7 47.8,48.7 | 47.8,48.7 47.8,52.5 v46.4,53.8 | 47.8,48.7 JP3.1
  Top 0.61: T1.C 47.5,62.1 T3.B
  Bottom 0.15: U$1.28 53.15,28.7
  Bottom 0.2: 53.15,28.7 53.15,29.4 52.95,29.6 v52.95,29.8
  Bottom 0.254: v63,39.7 70.6,39.7 71.7,40.8 86.25,40.8 v86.65,40.45
  Bottom 0.305: v46.4,53.8 46.5,58.9 47.5,60 v47.5,61.2
CLOCK  (via drill 0.3)
  Top 0.15: v35.4,27.5 34.9,27 34.9,23.2 | 34.9,23.2 34.9,9.1 32.4,6.6 SV1.15 | v29.3,22.2 30.3,23.2 34.9,23.2
  Bottom 0.15: v35.4,27.5 49.1,27.5 49.6,27.2 U$1.24 | v29.3,22.2 25.5,22.2 SV2.11
GND  (via drill 0.3, 0.4, 0.6)
  Top 0.15: C29.2 53.2,23.9 | C28.2 55.9,23.9 | v98.5,6.6 98.5,41.1 98.5,41.39
  Top 0.254: C28.2 55.6,23.68 v54.68,22.76
  Top 0.305: v54.8,31.25 54.3,32 | 54.3,32 v52.7,32 | 54.3,32 55,32.7 55,36.9 v57.2,37.3 | 55.9,23.9 56.4,23.9 57.2,24.7 57.2,26.6 v56.5,27.3 | C28.2 C29.2
  Bottom 0.15: v54.68,22.76 54.6,22.3 54.25,21.95 53.8,21.5 53.2,21.5 53,21.7 52.3,21.7 51.65,21.05 U$1.12 51.15,19.35 48.05,19.35 46.95,18.3 44.9,18.3 44.25,18.85 C27.2 | v56.5,27.3 56,27.3 55.65,27.65 U$1.33
  Bottom 0.2: U$1.33 55.65,29.25 55.3,29.6 55.3,30.9 v54.8,31.25 54.65,30.75 U$1.31 | U$1.25 U$1.27
  Bottom 0.254: v54.68,22.76 54.58,22.28 54.25,21.95
  Bottom 0.305: v52.7,32 50.1,32 v49.5,31.4 | 54.6,23.9 54.6,23.6 54.5,23.5
  other vias: 38.8,76.2 57.7,71.7 77.1,71.9 98.1,73.2 77,52.1 61.6,54 43.5,54.2 21.7,75.3 28.6,43.6 30.5,58.7 81.4,12.2 10.4,8.5 64.1,21.9 63.6,11.3 20.4,12.5 15.8,41.5 57.3,42.7
  pour Bottom (isolate 0.254): 0,0 107,0 107.2,80.1 0,80
  pour Top (isolate 0.254): 0,0 107.2,0 107,80 0,80
HSYNC
  Top 0.15: SV1.16 32.3,4.1 31.4,5 31.4,17.1 SV3.16
  Bottom 0.15: SV5.1 86.8,4.6 83.4,2.3 34.2,2.3 32.5,4 32.4,4 SV1.16
IO1  (via drill 0.3)
  Top 0.15: v45.2,34.7 45.6,34.7 46.3,34.1 46.3,30.8 48.1,29.5 52.1,29.5 53.7,27.9 57.7,27.9 61.6,24 61.6,4 62.7,2.9 78,2.9 78,5.5 78.6,6.3 81.7,6.3 SV4.4
  Bottom 0.15: v45.2,34.7 36.2,34.7 33.9,32.4 SV3.3
IO2  (via drill 0.3)
  Top 0.15: v43.6,14.6 43.6,16.45 41.9,18.15 41.9,35.6 41.6,35.9 31,35.9 30.3,35.2 30.3,33.4 31.3,32.4 SV3.4 | v62.5,14.8 71,6.3 76.6,6.3 76.6,4.6 SV4.2
  Bottom 0.15: v43.6,14.6 43.9,14.9 47.9,14.9 48.1,14.7 50.1,14.7 50.2,14.8 v62.5,14.8
LASERONOFF  (via drill 0.3)
  Top 0.15: v48.6,34.9 53.7,29.8 53.7,29 57.3,29 62,24.2 61.9,5 62.8,4.1 SV1.40
  Bottom 0.15: v48.6,34.9 48.2,35.3 36.3,35.3 34.3,33.3 33.5,33.3 32.9,32.7 32.9,30.7 32.3,30.7 31.5,29.9 31.4,29.9 SV3.6
N$1  (via drill 0.6)
  Top 0.61: v64.8,67.2 T8.E
  Bottom 0.61: v64.8,67.2 62.5,67.2 R1.1
N$2
  Bottom 0.15: U$1.11 52.15,19.25 51.8,18.9 48.75,18.9 47.05,17.45 42,17.45 40.75,18.7 R30.1
N$3  (via drill 0.6)
  Top 0.61: v86.1,60.8 T5.E
  Bottom 0.406: R3.3 90.2,55.85
  Bottom 0.61: v86.1,60.8 86.1,58.2 88.4,55.9 90.05,55.9 R3.3
N$4
  Bottom 0.2: U$1.36 57.15,29.5 58.2,32 C19.1
N$5
  Bottom 0.305: R17.1 R3.2
N$6
  Bottom 1.016: B1.AC1 27.23,68.93 28.4,70.1 28.4,71.85 X2.2
N$7
  Bottom 0.813: B1.AC2 25.2,73.2 27.5,75.5 28.35,75.5 X2.1
N$8  (via drill 0.6)
  Top 0.406: C25.1 9.41,67.4 10.76,66.05
  Top 0.61: D1.C 10.8,50.2 8.9,52 | 8.9,52 6.3,54.6 6.3,61.5 10.76,66.05 11.3,66.6 v17.9,66.6 19.8,68.5 23,68.5 24,67.5 24,64 25,63 27.5,63 29,61.5 29,57.5 27.37,55.87 IC5.10 | C17.+ 7.2,50.3 8.9,52
  Bottom 0.61: v17.9,66.6 18.5,66.6 18.7,66.4
  Bottom 0.813: 18.35,75.05 X4.2 | C16.+ 15.95,70.15 16.1,70.3
  Bottom 1.016: 18.35,75.05 16.1,72.2 16.1,70.3 | 15.95,70.15 16.3,69.8 17.4,69.8 18.27,68.93 B1.+ 19.2,66.9 18.7,66.4 18.8,66.3 18.8,64.9 16.6,62.6 16.6,57 15.9,56.3 IC4.1
N$9
  Bottom 0.406: 5.8,61.4 5.4,61.4 4.3,62.5 R7.1 | 5.8,61.4 IC4.4 | R5.2 5.9,61.3 5.8,61.4
N$10
  Top 0.61: 65.4,59.2 T7.B | T9.E 64.1,60.6 65.4,59.2 | T8.B 62.8,68.7 61.6,69.9 57.7,69.9 56.3,68.5 56.3,57.6 | R4.1 56.3,57.6 | 65.4,59.2 65.4,58 64.4,57 56.9,57 56.3,57.6
N$11
  Bottom 0.2: U$1.35 56.65,31.55 56.6,32.6 C20.2
N$12
  Bottom 0.406: R7.2 4.3,72.5 5.9,74.1 7.53,74.1 R2.2
N$13  (via drill 0.6)
  Top 0.61: v48.8,60.6 T1.E
  Bottom 0.61: v48.8,60.6 48.8,59.4 51,57.2 51,54.85 R8.3
N$14
  Bottom 0.305: R27.1 R8.2
N$15
  Top 0.61: IC5.12 19.07,53.33 D8.C
  Top 0.813: L2.1 22.2,49.1 18.9,52.4 D8.C
N$16
  Bottom 0.254: R9.2 94.93,27.6 R10.2
N$17
  Bottom 1.016: IC4.2 D3.C 20.35,52.8 L1.1
N$18  (via drill 0.6)
  Top 0.61: v66.6,60.7 T7.E
  Bottom 0.61: R12.3 67.05,54.55 65.9,55.6 65.9,58.1 66.6,59.05 v66.6,60.7
N$19
  Top 0.254: R11.1 C11.2 90.15,35.75 89.09,36.81 U$2.1
N$20  (via drill 0.6)
  Top 0.61: T4.E v85.1,67.1
  Bottom 0.61: v85.1,67.1 81.8,67.1 R15.1
N$21
  Top 0.61: T6.E 84.1,60.8 85.6,59.3 | 85.6,59.3 T5.B | T4.B 82.8,68.6 81.9,69.5 76.7,69.5 75.7,68.5 75.7,58.4 77.5,56.6 78.75,56.6 R14.1 79.45,56.55 81,56.6 84.5,56.6 85.6,57.7 85.6,59.3
N$22
  Bottom 0.305: R6.1 R12.2
N$23  (via drill 0.6)
  Top 0.406: v6.5,64.4 5.7,64.9 R35.1 4.1,65.05 4.1,66.5 3.05,67.55 R36.2
  Bottom 0.406: v6.5,64.4 6.5,63.7 7.4,63.1 IC4.5
N$24
  Bottom 0.254: R20.2 96.3,21.2 97.4,22.3 97.4,24.41 R22.2
N$25
  Bottom 0.254: R32.2 95.13,33.1 R33.2
N$26  (via drill 0.3)
  Top 0.305: U$3.2 U$3.5 U$3.6 93,18.84 v92.7,19.4
  Bottom 0.254: v92.7,19.4 92.7,20.85 R20.1
N$27  (via drill 0.3)
  Top 0.254: U$4.6 U$4.5 U$4.2 v88.25,29.6
  Bottom 0.305: v88.25,29.6 89.1,29.6 R9.1
N$28
  Top 0.254: U$2.4 83.96,38.11 83.15,37.3 C12.2
  Top 0.406: C12.2 R19.1
N$29  (via drill 0.3)
  Top 0.15: v61.4,28 61.4,29.5 65.2,33.3 v65.2,40.7
  Bottom 0.15: v65.2,40.7 65.8,41.3 R13.1 | U$1.37 59.05,27.15 60,28 v61.4,28
N$30
  Bottom 0.2: R13.2 90.5,41.3 92.6,43.4 96.6,43.4 97.4,42.6 R18.2
N$31
  Top 0.254: U$3.1 88.5,17.95 R23.1
  Top 0.305: R23.1 88.15,20.6 C9.2
N$32
  Top 0.61: T2.B 45.3,67.8 44.3,69 40.3,69 38.4,66.9 38.4,58.75 R16.1 40.25,57.1 41.3,57.1 41.8,56.7 47.2,56.7 48.1,57.6 48.1,59 48.2,59.1 | 48.2,59.1 T1.B | T3.E 46.7,60.6 48.2,59.1
N$33
  Top 0.254: R24.1 91.05,14.6 91.4,14.25 | 91.4,14.25 C10.2 | U$3.4 92.99,15.84 91.4,14.25
N$34
  Bottom 0.15: R31.1 61.8,30.1 63,28.9 63,28 62.75,27.75 | U$1.38 59.2,26.65 60.05,27.4 62.4,27.4 62.75,27.75 | R34.2 63.9,26.6 62.75,27.75
  Bottom 0.2: R31.1 63.35,32.25 C4.2
N$35  (via drill 0.5)
  Top 0.406: v16.5,65 18.7,65 20.6,66.9 v22.2,66.9
  Bottom 0.254: 28.3,54.4 28.3,48.8 26.5,47 26.5,40 25.5,39 7.04,39 LED2.A
  Bottom 0.406: v22.2,66.9 22.2,64.95 L1.2 | R2.1 7.73,66.57 9.3,65 v16.5,65
  Bottom 1.016: C6.+ 29.1,53.6 28.3,54.4 28.3,60.8 29.5,62 30.5,62 C7.+ 30.6,62.4 27.5,65.5 | 27.5,65.5 23.35,65.5 L1.2 | L3.2 27.46,65.54 27.5,65.5
N$36  (via drill 0.3)
  Top 0.254: U$2.2 89.49,37.46 v89.9,37.05
  Top 0.305: U$2.6 U$2.5 U$2.2
  Bottom 0.254: v89.9,37.05 89.9,34.65 R32.1
N$37  (via drill 0.3, 0.6)
  Top 0.2: 53.7,25.75 C29.1 53.15,25.8
  Top 0.305: C28.1 53.7,25.75 54.2,26.25 v54.2,27.3
  Top 0.61: 44.3,33.6 44.3,28 45.4,26.9 v45.4,23.25 | C29.1 53.2,25.8 | 44.3,33.6 L4.1 | 44.3,33.6 v45,33.6
  Bottom 0.15: R30.2 41.65,21.8 42.9,23.15 45.45,23.15 v45.4,23.25
  Bottom 0.2: 53.65,29.6 U$1.29 | v54.2,27.3 54.15,27.35 U$1.30 54.15,29.1 53.65,29.6 | U$1.13 47.45,21.65 46.8,21.85 C30.1 | 53.65,29.6 53.65,33.3 C26.1
  Bottom 0.61: C30.1 C27.1 | v45.4,23.25 45.4,23.05 45.9,22.55 C30.1 | C30.1 45.9,20.95 | C26.1 C31.1 50.35,33.6 v45,33.6 | C19.2 C20.1 56.45,34.3 55.2,34.3 | 53.65,33.3 54.2,33.3 55.2,34.3 | 55.2,34.3 55.3,34.4 55.3,36.5 53.2,38.6 C5.+
N$38
  Top 0.254: U$4.1 87.45,28.95 87.9,28.6 88.9,28.6 89.3,28.9 89.3,30 88.3,30.9 87.7,30.9 86.35,32.25 C3.2
  Top 0.406: C3.2 R26.1
N$39
  Top 0.254: U$4.4 84.45,30.25 83.85,29.7 83.85,27.65 84.55,26.95 85.8,26.95
  Top 0.305: C8.2 85.8,26.95
  Top 0.406: R28.1 C8.2
N$40
  Top 0.406: R36.1 4.7,69.45 C25.2
N$41  (via drill 0.6)
  Top 0.61: T2.E v47.5,66.3
  Bottom 0.61: v47.5,66.3 45.6,66.3 R25.1
N$43
  Bottom 0.254: U$5.5 U$5.6 7.55,32.1 7.55,31.55 8.2,30.9 8.2,29.65 R37.1
N$44  (via drill 0.3)
  Top 0.254: v4.4,29.9 v4.4,32.9
  Bottom 0.254: LED2.C 6.6,34.9 5.9,34.2 U$5.3 5.15,33.45 4.6,32.9 v4.4,32.9 | R37.2 4.7,29.6 v4.4,29.9
N$45
  Bottom 0.2: 6.2,32.8 6.4,32.8 7.05,33.45 U$5.4
  Bottom 0.254: U$5.2 6.2,32.8 | 7.45,33.4 U$5.4 8.8,33.45 R21.2
N$47
  Bottom 0.406: LED5.C 2.4,30.55 R38.2
N$56
  Top 0.406: 66.3,67.4 66.4,67.5 71.2,67.5 71.6,67.9 D4.A
  Top 0.61: T8.C 65.1,65.7 66.3,66.8 66.3,67.4 66.3,69.4 61.1,74.2 61.1,75.05 X5.2
N$82
  Top 0.406: 86.8,66.6 86.9,66.7 90.9,66.7 D2.A
  Top 0.61: T4.C 85.8,65.6 86.8,66.6 86.8,69.4 80.5,74.5 80.5,75.35 X1.2
N$84
  Top 0.406: 49.4,65.8 52.6,65.8 D5.A
  Top 0.61: T2.C 48.4,64.8 49.4,65.8 49.4,68.9 42.6,74.6 42.6,75.65 X3.2
VDD_LASERSUPPLY  (via drill 0.3, 0.6)
  Top 0.305: 86.3,14.55 R24.2 | 45.2,59.1 T3.C | 62.6,59.1 T9.C | v66.6,30.9 76.95,30.9 77.8,30.9 79.15,32.25 C3.1
  Top 0.406: R24.2 R23.2 | C10.1 93.65,12.55 93.2,12.1 87.2,12.1 86.3,13 86.3,14.55 | 94.9,13.8 94.9,20.2 93.7,21.4 C9.1 90.9,21.45 90.9,22.4 88.95,24.35 R28.2 C8.1 | C3.1 R26.2 C12.1 R19.2 80.4,42.6 82.9,45.05 v92.05,45.05 C11.1 R11.2 | D4.C 71.6,72.6 69,75.2 64.75,75.2 X5.1 | D2.C 91.5,73.8 89.8,75.5 84.05,75.5 X1.1 | D5.C 52.7,70.5 47.5,75.7 X3.1
  Top 0.61: T9.C 63.3,59.08 | T6.C 82.08,59.32 v81.3,58 | 45.2,59.1 44.4,58.3 41.5,58.3 40.2,59.6 40.2,61.6 41.3,62.7 43.5,62.7 44.2,63.4 48.8,63.4 v49.3,63.9 | 62.6,59.1 61.6,58.2 58.4,58.2 57.5,59 57.5,62.8 58.4,63.7 65.1,63.7 v66.5,65.1 | v96.4,13.8 94.9,13.8 93.75,13.8 C10.1
  Bottom 0.305: R31.2 64.65,34.35 66.6,32.4 v66.6,30.9
  Bottom 0.406: v92.05,45.05 104.7,45.05
  Bottom 0.61: 89.5,64.3 89.5,66.6 C1.+ | 50.8,64 50.7,63.9 50.8,63.8 | v81.3,58 81.3,62.4 83.1,64.2 89.4,64.2 89.5,64.3 | 89.5,64.3 95.9,64.3 104.7,55.5 104.7,45.05 104.7,18.2 102.75,16.35 100.2,13.8 v96.4,13.8 | 50.8,67 51.05,66.75 | v66.5,65.1 69.3,65.1 69.4,65 | 70.5,67 C13.1 | C21.1 70.75,69.25 70.5,69.5
  Bottom 1.016: C36.+ 48.8,75.7 X3.1 43.55,73.2 36,73.2 32.1,69.4 32.04,69.34 L3.1 | 69.15,74.15 C38.+ 69.5,71.9 70.5,70.9 70.5,69.5 70.5,67 69.4,65.9 69.4,65 C39.+ | 69.15,74.15 68.2,75.1 X5.1 64.65,75.55 63.1,77.1 54.2,77.1 C36.+ | 89.4,71.5 C2.+ 87.6,75.4 X1.1 83.95,76.05 82.7,77.3 72.3,77.3 69.15,74.15 | 89.4,69 89.4,71.5 | C1.+ 89.4,69 | 50.7,63.9 v49.3,63.9 | 50.8,63.8 C37.+ | C36.+ 50.8,69.25 | 50.8,69.25 50.8,67 50.8,64 | 50.8,69.25 C14.1 | 51.05,66.75 C15.1 | 89.4,69 C23.1 | 89.4,71.5 C22.1
VSYNC  (via drill 0.3)
  Top 0.15: 28.25,2.45 28.2,2.4 23.5,2.4 23.1,2.8 23.1,15.1 21.9,16.3 21.9,30.3 22.8,31.2 23.9,31.2 24.3,31.6 24.3,32.6 25.1,33.4 28.75,33.4 30.95,31.2 35,31.2 35.2,31.4 v35.4,31.4 | 28.25,2.45 29.8,4 SV1.14 | v59.8,1.7 92.9,1.7 95.8,4.6 SV6.1 | v38,1 31.1,1 28.3,2.4 28.25,2.45
  Bottom 0.15: v35.4,31.4 35.4,30.4 34.9,29.9 33.8,29.9 SV3.5 | v59.8,1.7 59.7,1.6 58.8,1.6 58.1,0.9 38.1,0.9 v38,1
VU  (via drill 0.6)
  Top 0.61: v10.6,27.8 10.5,39.4 13,41.9 D1.A
  Bottom 0.61: v10.6,27.8 8.6,25.8 6.7,25.8 3.4,22.5 3.4,8.9 8.27,4.03 SV1.2

### Text on the board
Top: Tripple channel 330Mhz currentsource | das-labor.org | by siro 2011
tDocu: das-labor.org | made by siro 2011 | 3x DAC Current Source 10 bit